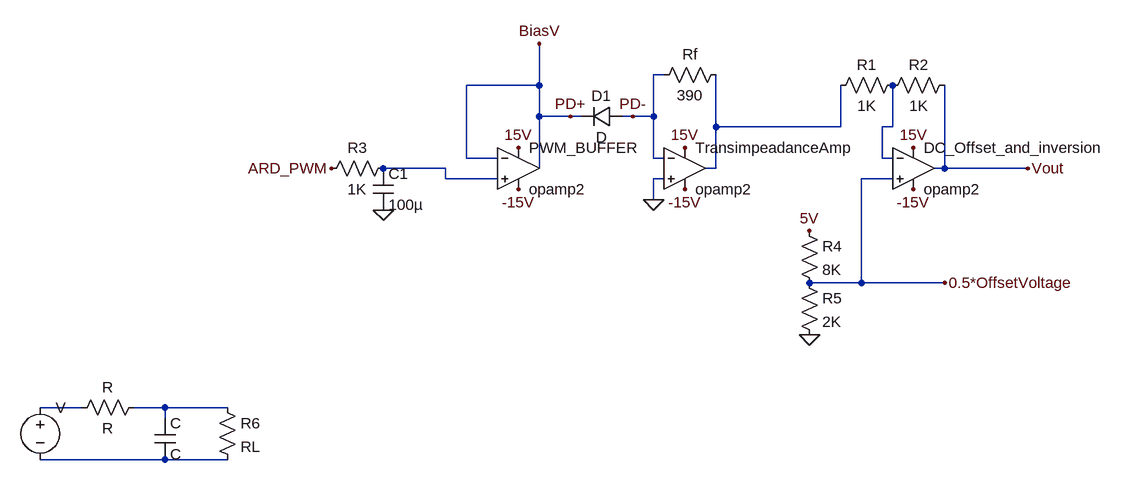
[diagram p0: schematic Final Circuit Diagram.asc]
Final Circuit Diagram.asc, the LTspice schematic file:
Version 4
SHEET 1 880 680
WIRE 144 -16 128 -16
WIRE -48 0 -48 -64
WIRE -48 0 -160 0
WIRE -48 48 -48 0
WIRE 0 48 -48 48
WIRE 16 48 0 48
WIRE 96 48 80 48
WIRE 128 48 128 -16
WIRE 128 48 96 48
WIRE 224 64 224 -16
WIRE 416 64 416 0
WIRE 416 64 224 64
WIRE 496 64 496 0
WIRE 496 64 480 64
WIRE -160 112 -160 0
WIRE -112 112 -160 112
WIRE 128 112 128 48
WIRE 144 112 128 112
WIRE 480 112 480 64
WIRE 496 112 480 112
WIRE -192 128 -288 128
WIRE -48 128 -48 48
WIRE 224 128 224 64
WIRE 224 128 208 128
WIRE 576 128 576 0
WIRE 576 128 560 128
WIRE 704 128 576 128
WIRE -192 144 -192 128
WIRE -112 144 -192 144
WIRE 144 144 128 144
WIRE 496 144 448 144
WIRE 128 176 128 144
WIRE 448 304 448 144
WIRE 448 304 368 304
WIRE 576 304 448 304
WIRE -752 496 -816 496
WIRE -624 496 -672 496
WIRE -528 496 -624 496
WIRE -624 512 -624 496
WIRE -624 576 -816 576
WIRE -528 576 -624 576
FLAG -288 192 0
FLAG -368 128 ARD_PWM
FLAG 128 176 0
FLAG 0 48 PD+
FLAG 96 48 PD-
FLAG 368 384 0
FLAG 368 224 5V
FLAG 528 96 15V
FLAG 176 96 15V
FLAG -80 96 15V
FLAG -80 160 -15V
FLAG 176 160 -15V
FLAG 528 160 -15V
FLAG 704 128 Vout
FLAG 576 304 0.5*OffsetVoltage
FLAG -48 -64 BiasV
SYMBOL OpAmps\\opamp2 -80 64 R0
SYMATTR InstName PWM_BUFFER
SYMBOL OpAmps\\opamp2 176 64 R0
SYMATTR InstName TransimpeadanceAmp
SYMBOL OpAmps\\opamp2 528 64 R0
SYMATTR InstName DC_Offset_and_inversion
SYMBOL cap -304 128 R0
SYMATTR InstName C1
SYMATTR Value 100µ
SYMBOL res -272 112 R90
WINDOW 0 0 56 VBottom 2
WINDOW 3 32 56 VTop 2
SYMATTR InstName R3
SYMATTR Value 1K
SYMBOL res 240 -32 R90
WINDOW 0 0 56 VBottom 2
WINDOW 3 32 56 VTop 2
SYMATTR InstName Rf
SYMATTR Value 390
SYMBOL res 592 -16 R90
WINDOW 0 0 56 VBottom 2
WINDOW 3 32 56 VTop 2
SYMATTR InstName R2
SYMATTR Value 1K
SYMBOL res 400 16 R270
WINDOW 0 32 56 VTop 2
WINDOW 3 0 56 VBottom 2
SYMATTR InstName R1
SYMATTR Value 1K
SYMBOL res 352 208 R0
SYMATTR InstName R4
SYMATTR Value 8K
SYMBOL res 352 288 R0
SYMATTR InstName R5
SYMATTR Value 2K
SYMBOL diode 80 32 R90
WINDOW 0 0 32 VBottom 2
WINDOW 3 32 32 VTop 2
SYMATTR InstName D1
SYMBOL res -544 480 R0
SYMATTR InstName R6
SYMATTR Value RL
SYMBOL cap -640 512 R0
SYMATTR InstName C
SYMBOL res -656 480 R90
WINDOW 0 0 56 VBottom 2
WINDOW 3 32 56 VTop 2
SYMATTR InstName R
SYMBOL voltage -816 480 R0
SYMATTR InstName V
SYMATTR Value ""

The netlist it stands for:
* Final Circuit Diagram.asc
XPWM_BUFFER N003 BiasV 15V -15V BiasV opamp2  ; pins In+ In- V+ V- OUT
XTransimpeadanceAmp 0 PD- 15V -15V N001 opamp2  ; pins In+ In- V+ V- OUT
XDC_Offset_and_inversion 0.5*OffsetVoltage N002 15V -15V Vout opamp2  ; pins In+ In- V+ V- OUT
C1 N003 0 100µ
R3 N003 ARD_PWM 1K
Rf N001 PD- 390
R2 Vout N002 1K
R1 N001 N002 1K
R4 5V 0.5*OffsetVoltage 8K
R5 0.5*OffsetVoltage 0 2K
D1 PD- BiasV D
R6 N005 N006 RL
C N005 N006 C
R N005 N004 R
V N004 N006
.model D D
.lib standard.dio
.backanno
.end